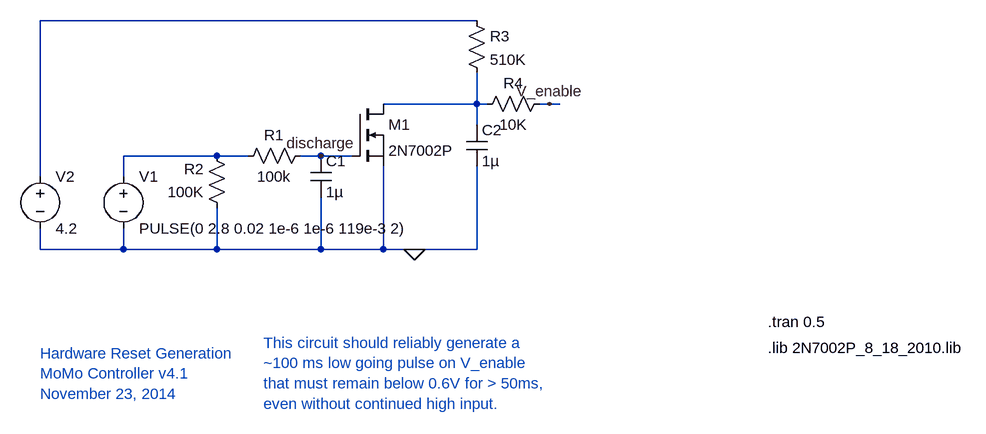
[diagram p0: schematic reset_circuit.asc]
reset_circuit.asc, the LTspice schematic file:
Version 4
SHEET 1 1184 704
WIRE 416 128 -256 128
WIRE 416 256 416 208
WIRE 416 256 272 256
WIRE 432 256 416 256
WIRE 528 256 512 256
WIRE 544 256 528 256
WIRE 416 288 416 256
WIRE 16 336 -128 336
WIRE 64 336 16 336
WIRE 176 336 144 336
WIRE 224 336 176 336
WIRE -256 368 -256 128
WIRE -128 368 -128 336
WIRE -256 480 -256 448
WIRE -128 480 -128 448
WIRE -128 480 -256 480
WIRE 16 480 16 416
WIRE 16 480 -128 480
WIRE 176 480 176 400
WIRE 176 480 16 480
WIRE 272 480 272 352
WIRE 272 480 176 480
WIRE 320 480 272 480
WIRE 416 480 416 352
WIRE 416 480 320 480
FLAG 528 256 V_enable
FLAG 320 480 0
FLAG 176 336 discharge
SYMBOL nmos 224 256 R0
SYMATTR InstName M1
SYMATTR Value 2N7002P
SYMATTR Prefix X
SYMBOL res 160 320 R90
WINDOW 0 0 56 VBottom 2
WINDOW 3 32 56 VTop 2
SYMATTR InstName R1
SYMATTR Value 100k
SYMBOL res 32 432 R180
WINDOW 0 36 76 Left 2
WINDOW 3 36 40 Left 2
SYMATTR InstName R2
SYMATTR Value 100K
SYMBOL res 400 112 R0
SYMATTR InstName R3
SYMATTR Value 510K
SYMBOL res 416 272 R270
WINDOW 0 32 56 VTop 2
WINDOW 3 0 56 VBottom 2
SYMATTR InstName R4
SYMATTR Value 10K
SYMBOL cap 160 336 R0
SYMATTR InstName C1
SYMATTR Value 1µ
SYMBOL cap 400 288 R0
SYMATTR InstName C2
SYMATTR Value 1µ
SYMBOL voltage -128 352 R0
SYMATTR InstName V1
SYMATTR Value PULSE(0 2.8 0.02 1e-6 1e-6 119e-3 2)
SYMBOL voltage -256 352 R0
SYMATTR InstName V2
SYMATTR Value 4.2
TEXT 864 632 Left 2 !.lib 2N7002P_8_18_2010.lib
TEXT 864 592 Left 2 !.tran 0.5
TEXT -256 640 Left 2 ;Hardware Reset Generation\nMoMo Controller v4.1\nNovember 23, 2014
TEXT 88 624 Left 2 ;This circuit should reliably generate a\n~100 ms low going pulse on V_enable\nthat must remain below 0.6V for > 50ms,\neven without continued high input.

The netlist it stands for:
* reset_circuit.asc
XM1 N002 discharge 0 2N7002P  ; pins D G S
R1 discharge N003 100k
R2 0 N003 100K
R3 N001 N002 510K
R4 N002 V_enable 10K
C1 discharge 0 1µ
C2 N002 0 1µ
V1 N003 0 PULSE(0 2.8 0.02 1e-6 1e-6 119e-3 2)
V2 N001 0 4.2
.lib 2N7002P_8_18_2010.lib
.tran 0.5
* Hardware Reset Generation
* MoMo Controller v4.1
* November 23, 2014
* This circuit should reliably generate a
* ~100 ms low going pulse on V_enable
* that must remain below 0.6V for > 50ms,
* even without continued high input.
.backanno
.end